# Altium schematic sheet Sheet3.SchDoc
size A4; SheetNumber: 2; SheetTotal: 2
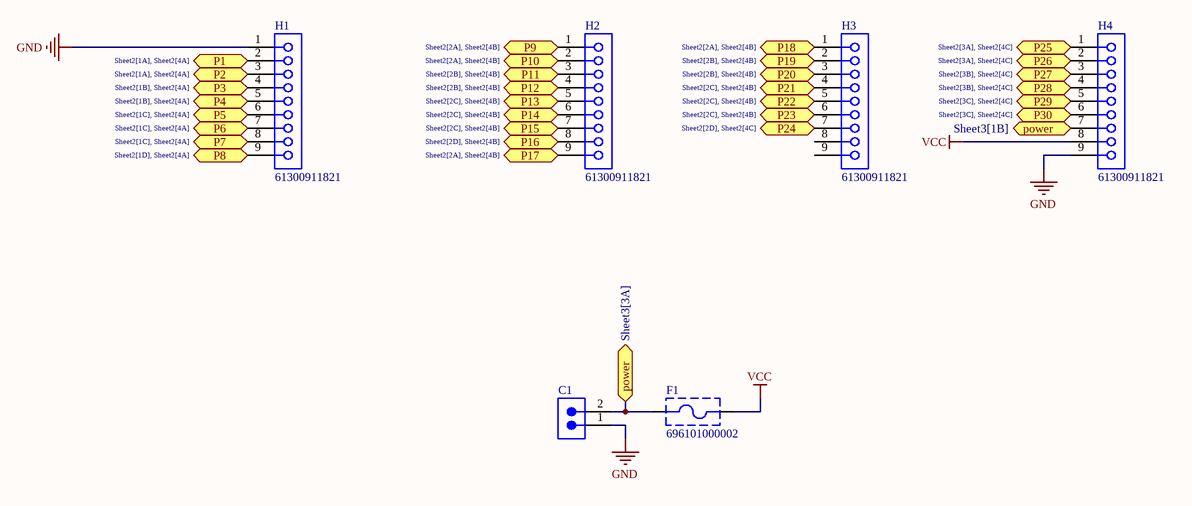
[diagram p0: Sheet3.SchDoc]

## Parts
C1  691313510002  [691313510002]  (value not drawn)
F1  696101000002  [696101000002]
H1  61300911821  [61300911821]
H2  61300911821  [61300911821]
H3  61300911821  [61300911821]
H4  61300911821  [61300911821]

## Ports
P1 (bidir, see Sheet2[1A], Sheet2[4A]), P2 (bidir, see Sheet2[1A], Sheet2[4A]), P3 (bidir, see Sheet2[1B], Sheet2[4A]), P4 (bidir, see Sheet2[1B], Sheet2[4A]), P5 (bidir, see Sheet2[1C], Sheet2[4A]), P6 (bidir, see Sheet2[1C], Sheet2[4A]), P7 (bidir, see Sheet2[1C], Sheet2[4A]), P8 (bidir, see Sheet2[1D], Sheet2[4A]), P9 (bidir, see Sheet2[2A], Sheet2[4B]), P10 (bidir, see Sheet2[2A], Sheet2[4B]), P11 (bidir, see Sheet2[2B], Sheet2[4B]), P12 (bidir, see Sheet2[2B], Sheet2[4B]), P13 (bidir, see Sheet2[2C], Sheet2[4B]), P14 (bidir, see Sheet2[2C], Sheet2[4B]), P15 (bidir, see Sheet2[2C], Sheet2[4B]), P16 (bidir, see Sheet2[2D], Sheet2[4B]), P17 (bidir, see Sheet2[2A], Sheet2[4B]), P18 (bidir, see Sheet2[2A], Sheet2[4B]), P19 (bidir, see Sheet2[2B], Sheet2[4B]), P20 (bidir, see Sheet2[2B], Sheet2[4B]), P21 (bidir, see Sheet2[2C], Sheet2[4B]), P22 (bidir, see Sheet2[2C], Sheet2[4B]), P23 (bidir, see Sheet2[2C], Sheet2[4B]), P24 (bidir, see Sheet2[2D], Sheet2[4C]), P25 (bidir, see Sheet2[3A], Sheet2[4C]), P26 (bidir, see Sheet2[3A], Sheet2[4C]), P27 (bidir, see Sheet2[3B], Sheet2[4C]), P28 (bidir, see Sheet2[3B], Sheet2[4C]), P29 (bidir, see Sheet2[3C], Sheet2[4C]), P30 (bidir, see Sheet2[3C], Sheet2[4C]), power (bidir, see Sheet3[1B]), power (bidir, see Sheet3[3A])

## Nets
GND: C1.1 H1.1 H4.9
VCC: F1.2 H4.8
P1: H1.2 ; port P1
P2: H1.3 ; port P2
P3: H1.4 ; port P3
P4: H1.5 ; port P4
P5: H1.6 ; port P5
P6: H1.7 ; port P6
P7: H1.8 ; port P7
P8: H1.9 ; port P8
P9: H2.1 ; port P9
P10: H2.2 ; port P10
P11: H2.3 ; port P11
P12: H2.4 ; port P12
P13: H2.5 ; port P13
P14: H2.6 ; port P14
P15: H2.7 ; port P15
P16: H2.8 ; port P16
P17: H2.9 ; port P17
P18: H3.1 ; port P18
P19: H3.2 ; port P19
P20: H3.3 ; port P20
P21: H3.4 ; port P21
P22: H3.5 ; port P22
P23: H3.6 ; port P23
P24: H3.7 ; port P24
P25: H4.1 ; port P25
P26: H4.2 ; port P26
P27: H4.3 ; port P27
P28: H4.4 ; port P28
P29: H4.5 ; port P29
P30: H4.6 ; port P30
power: C1.2 F1.1 H4.7 ; port power

Not connected (* = marked no-connect by the designer): H3 8 9

## Library data of the parts
C1 = CMP-1502-02192-3: 313; 5.08MM Pitch Straight Pluggable Term Block, Pcb Header, Through Hole, 2 Way; Number of Contacts: 2; Voltage: 300V; Number of Levels: 1; Color: Green; Gender: Male; Current: 20A; Pitch: 5.08mm; Number of Pins: 2; RoHS: Compliant; Length: 11.5mm; Width: 12.16mm; Packaging: Box; Max Operating Temperature: 105°C; Lead Pitch: 5.08mm; Mount: Through Hole; Number of Rows: 1; Voltage Rating: 300V; Contact Material: Tin; Height: 8.7mm; Contact Plating: Tin; Termination: Solder; Min Operating Temperature: -40°C; Number of Positions Per Level: 2; Current Rating: 20A
F1 = CMP-1502-00233-4: WR-FSH Fuse Holder Blocks Fuse Holder Blocks Clip Cover for PCB; Fuse Current: 10A; Voltage Rating (AC): 250V; Mount: Through Hole; REACH SVHC: Unknown; RoHS: Compliant; Height: 13.6mm; Packaging: Box; Min Operating Temperature: -30°C; Max Operating Temperature: 120°C
H1-H4 = CMP-1502-01331-4: THT Vertical Socket Header WR-PHD, Pitch 2.54 mm, Single Row, 9 pins; Gender: Female; Operating Supply Voltage: 250V; Contact Resistance: 20mΩ; Current Rating: 3A; Number of Pins: 9; Lead Pitch: 2.54mm; Orientation: Vertical